# Altium schematic sheet Power IO.SchDoc: Power Input/Output
size 203 x 127 mm; DrawnBy: Kace Chandler; DocumentNumber: 13; SheetNumber: 13; SheetTotal: 23
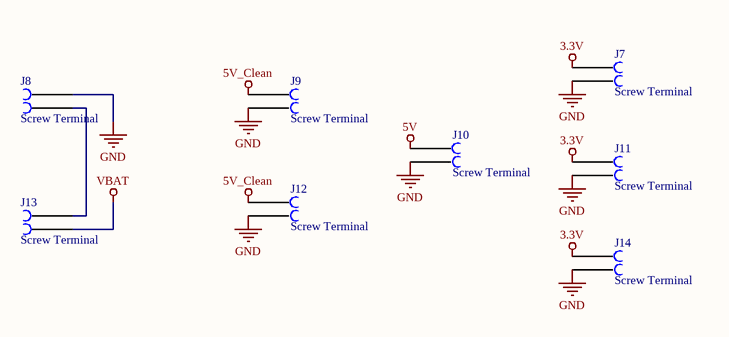
[diagram p0: Power IO.SchDoc]

## Parts
J7  Screw Terminal  [Screw Terminal]
J8  Screw Terminal  [Screw Terminal]
J9  Screw Terminal  [Screw Terminal]
J10  Screw Terminal  [Screw Terminal]
J11  Screw Terminal  [Screw Terminal]
J12  Screw Terminal  [Screw Terminal]
J13  Screw Terminal  [Screw Terminal]
J14  Screw Terminal  [Screw Terminal]

## Nets
3.3V: J7.1 J11.1 J14.1
5V: J10.1
5V_Clean: J9.1 J12.1
GND: J7.2 J8.2 J9.2 J10.2 J11.2 J12.2 J14.2
VBAT: J13.1
NetJ8_1: J8.1 J13.2

## Library data of the parts
J7-J14 = Screw Terminal: Supplier 1: Digi-Key; Supplier Part Number 1: A112762-ND